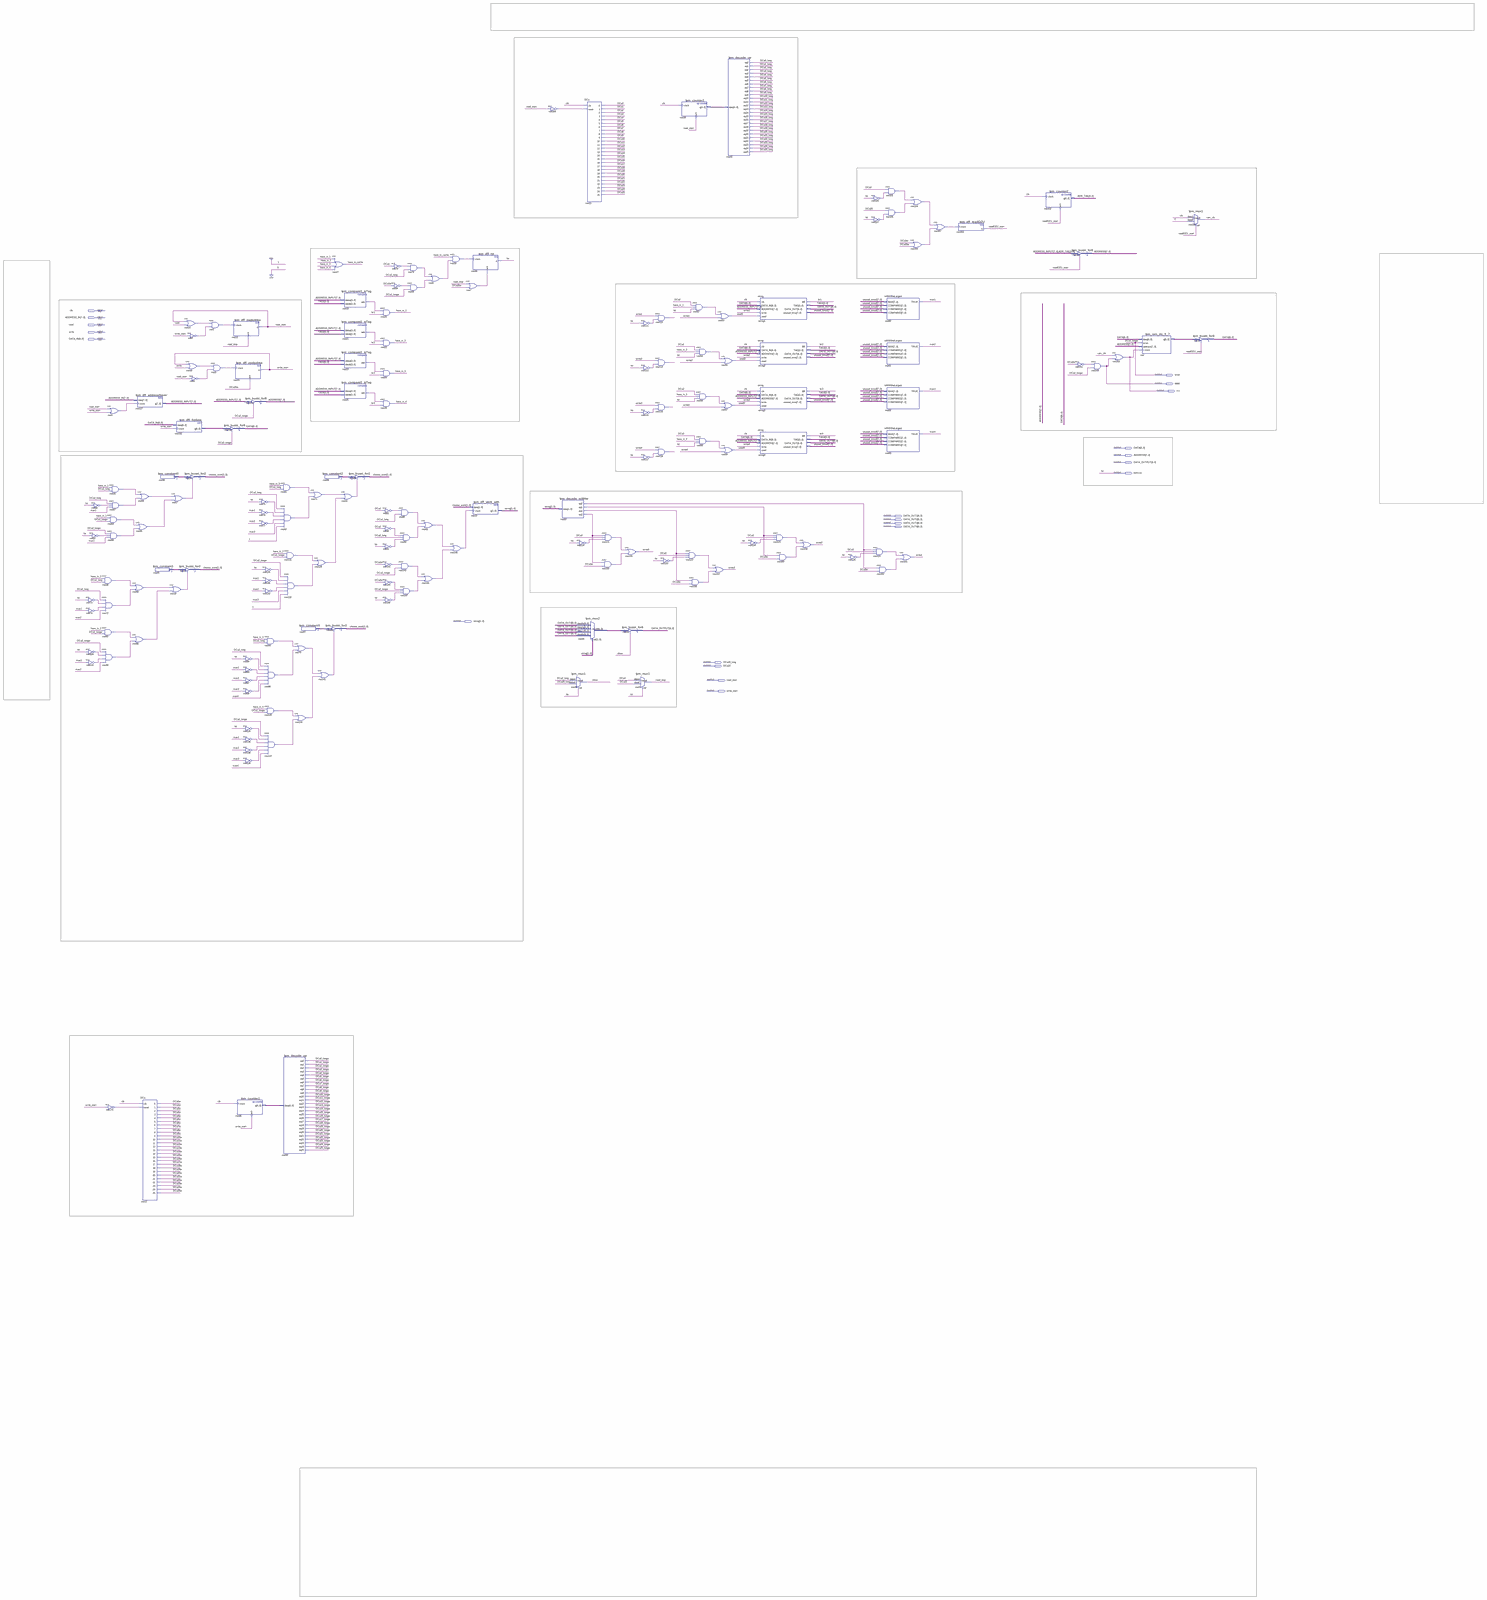
[diagram p0: schematic sheet, whole]
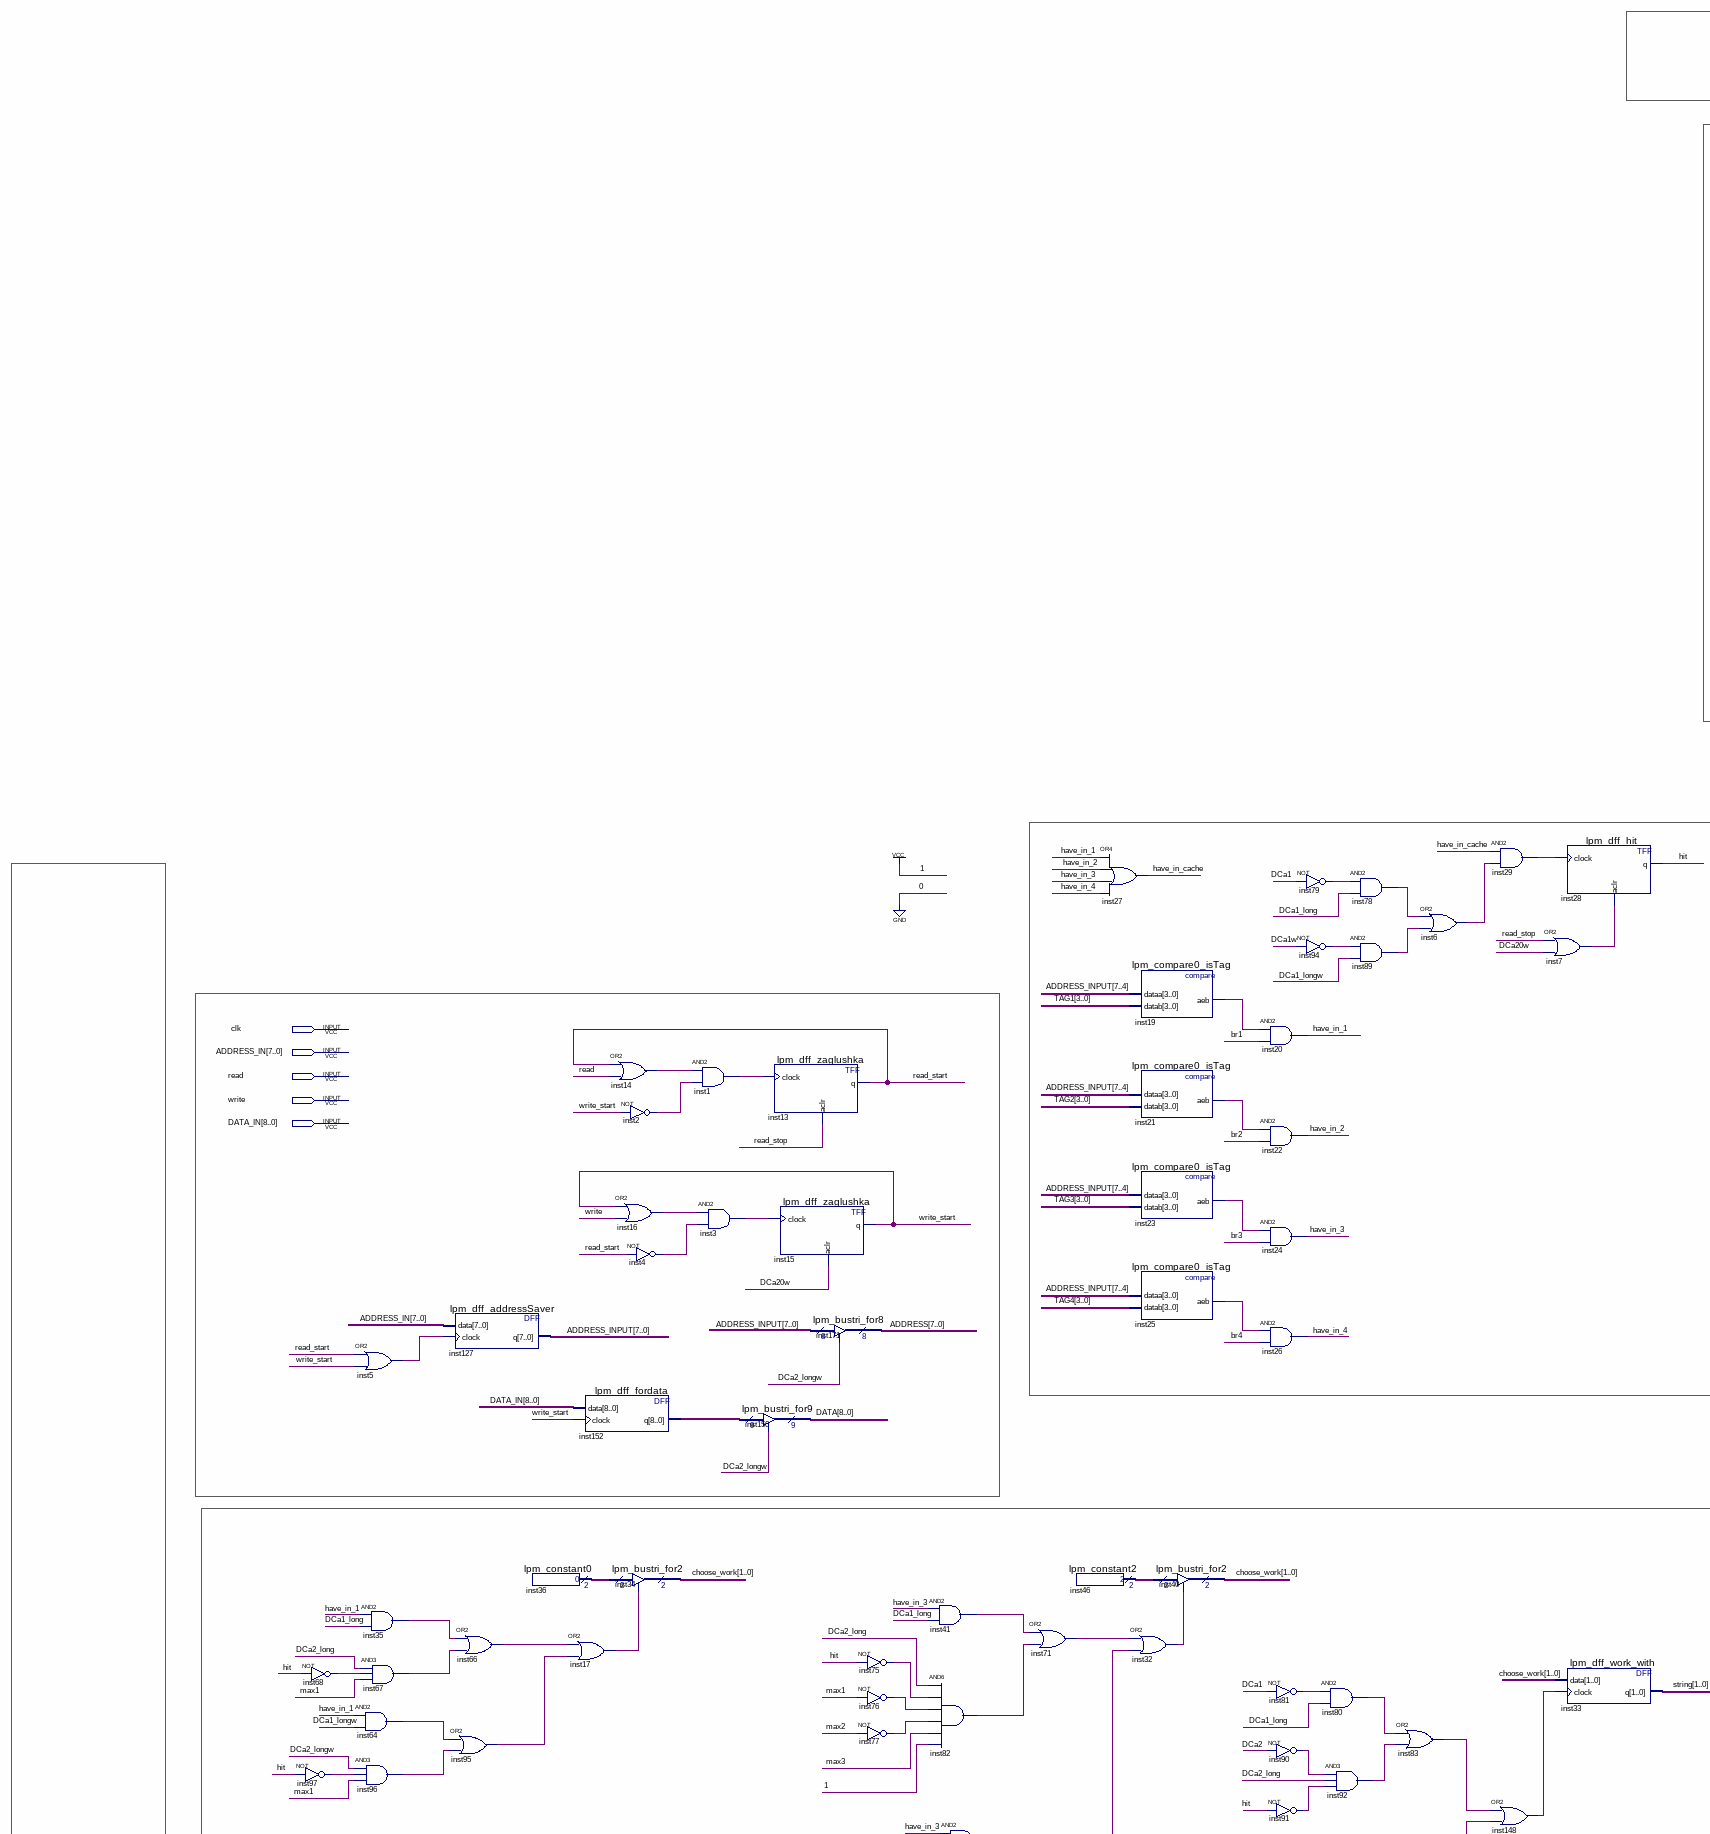
[diagram p1: schematic sheet, upper left part]
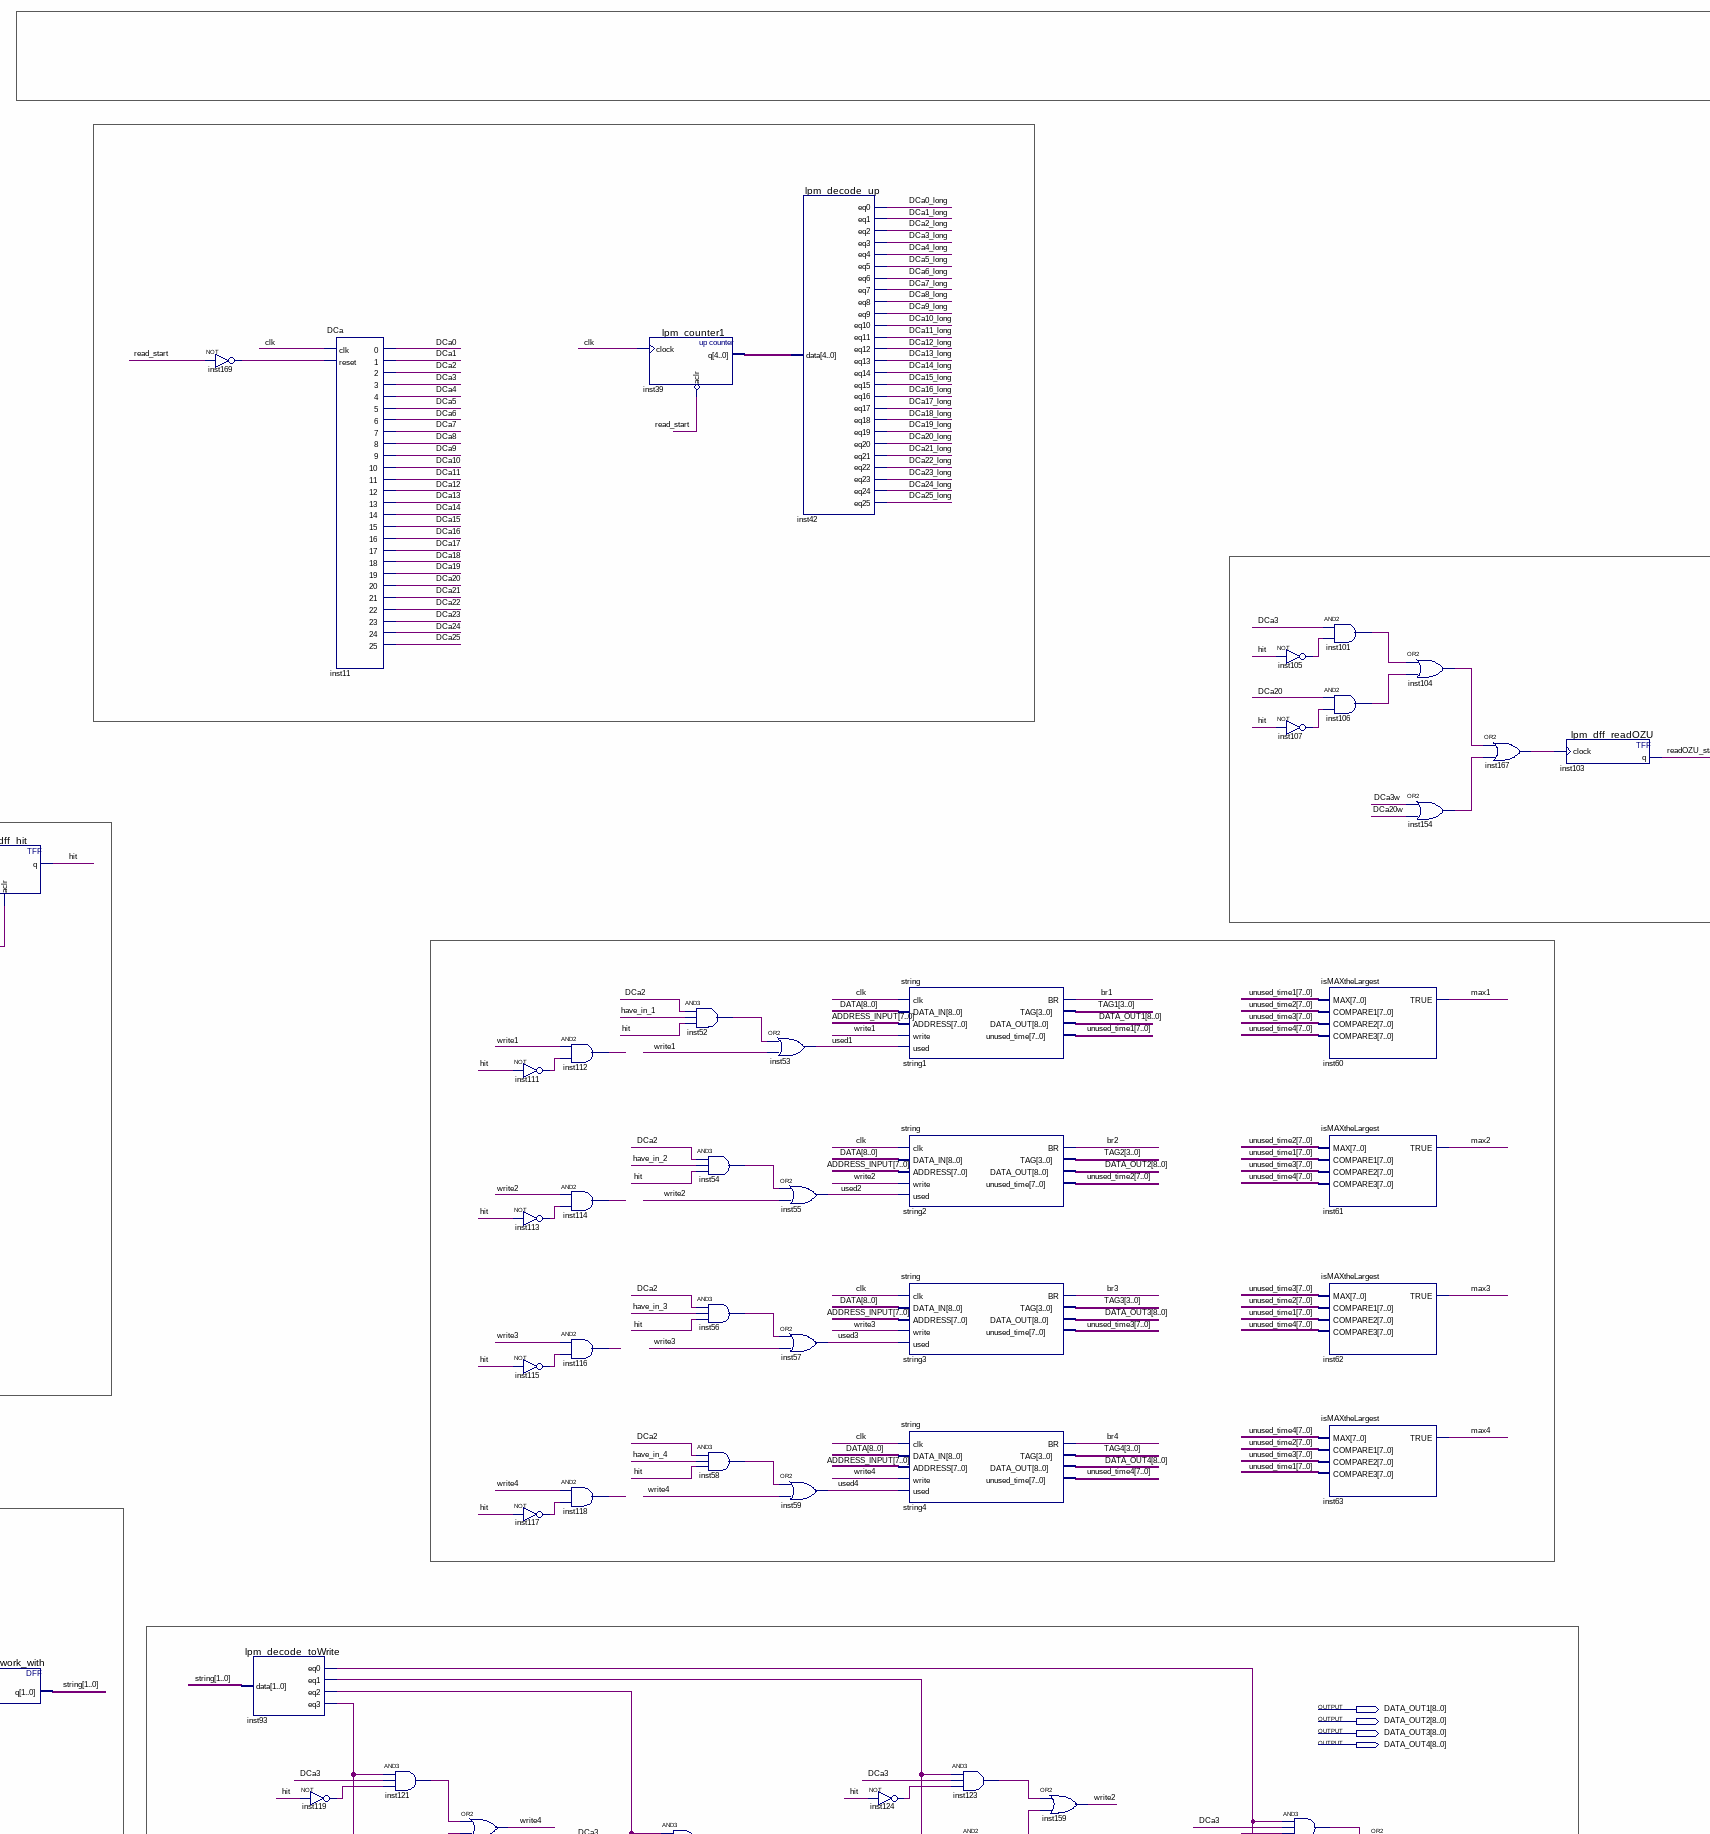
[diagram p2: schematic sheet, upper centre part]
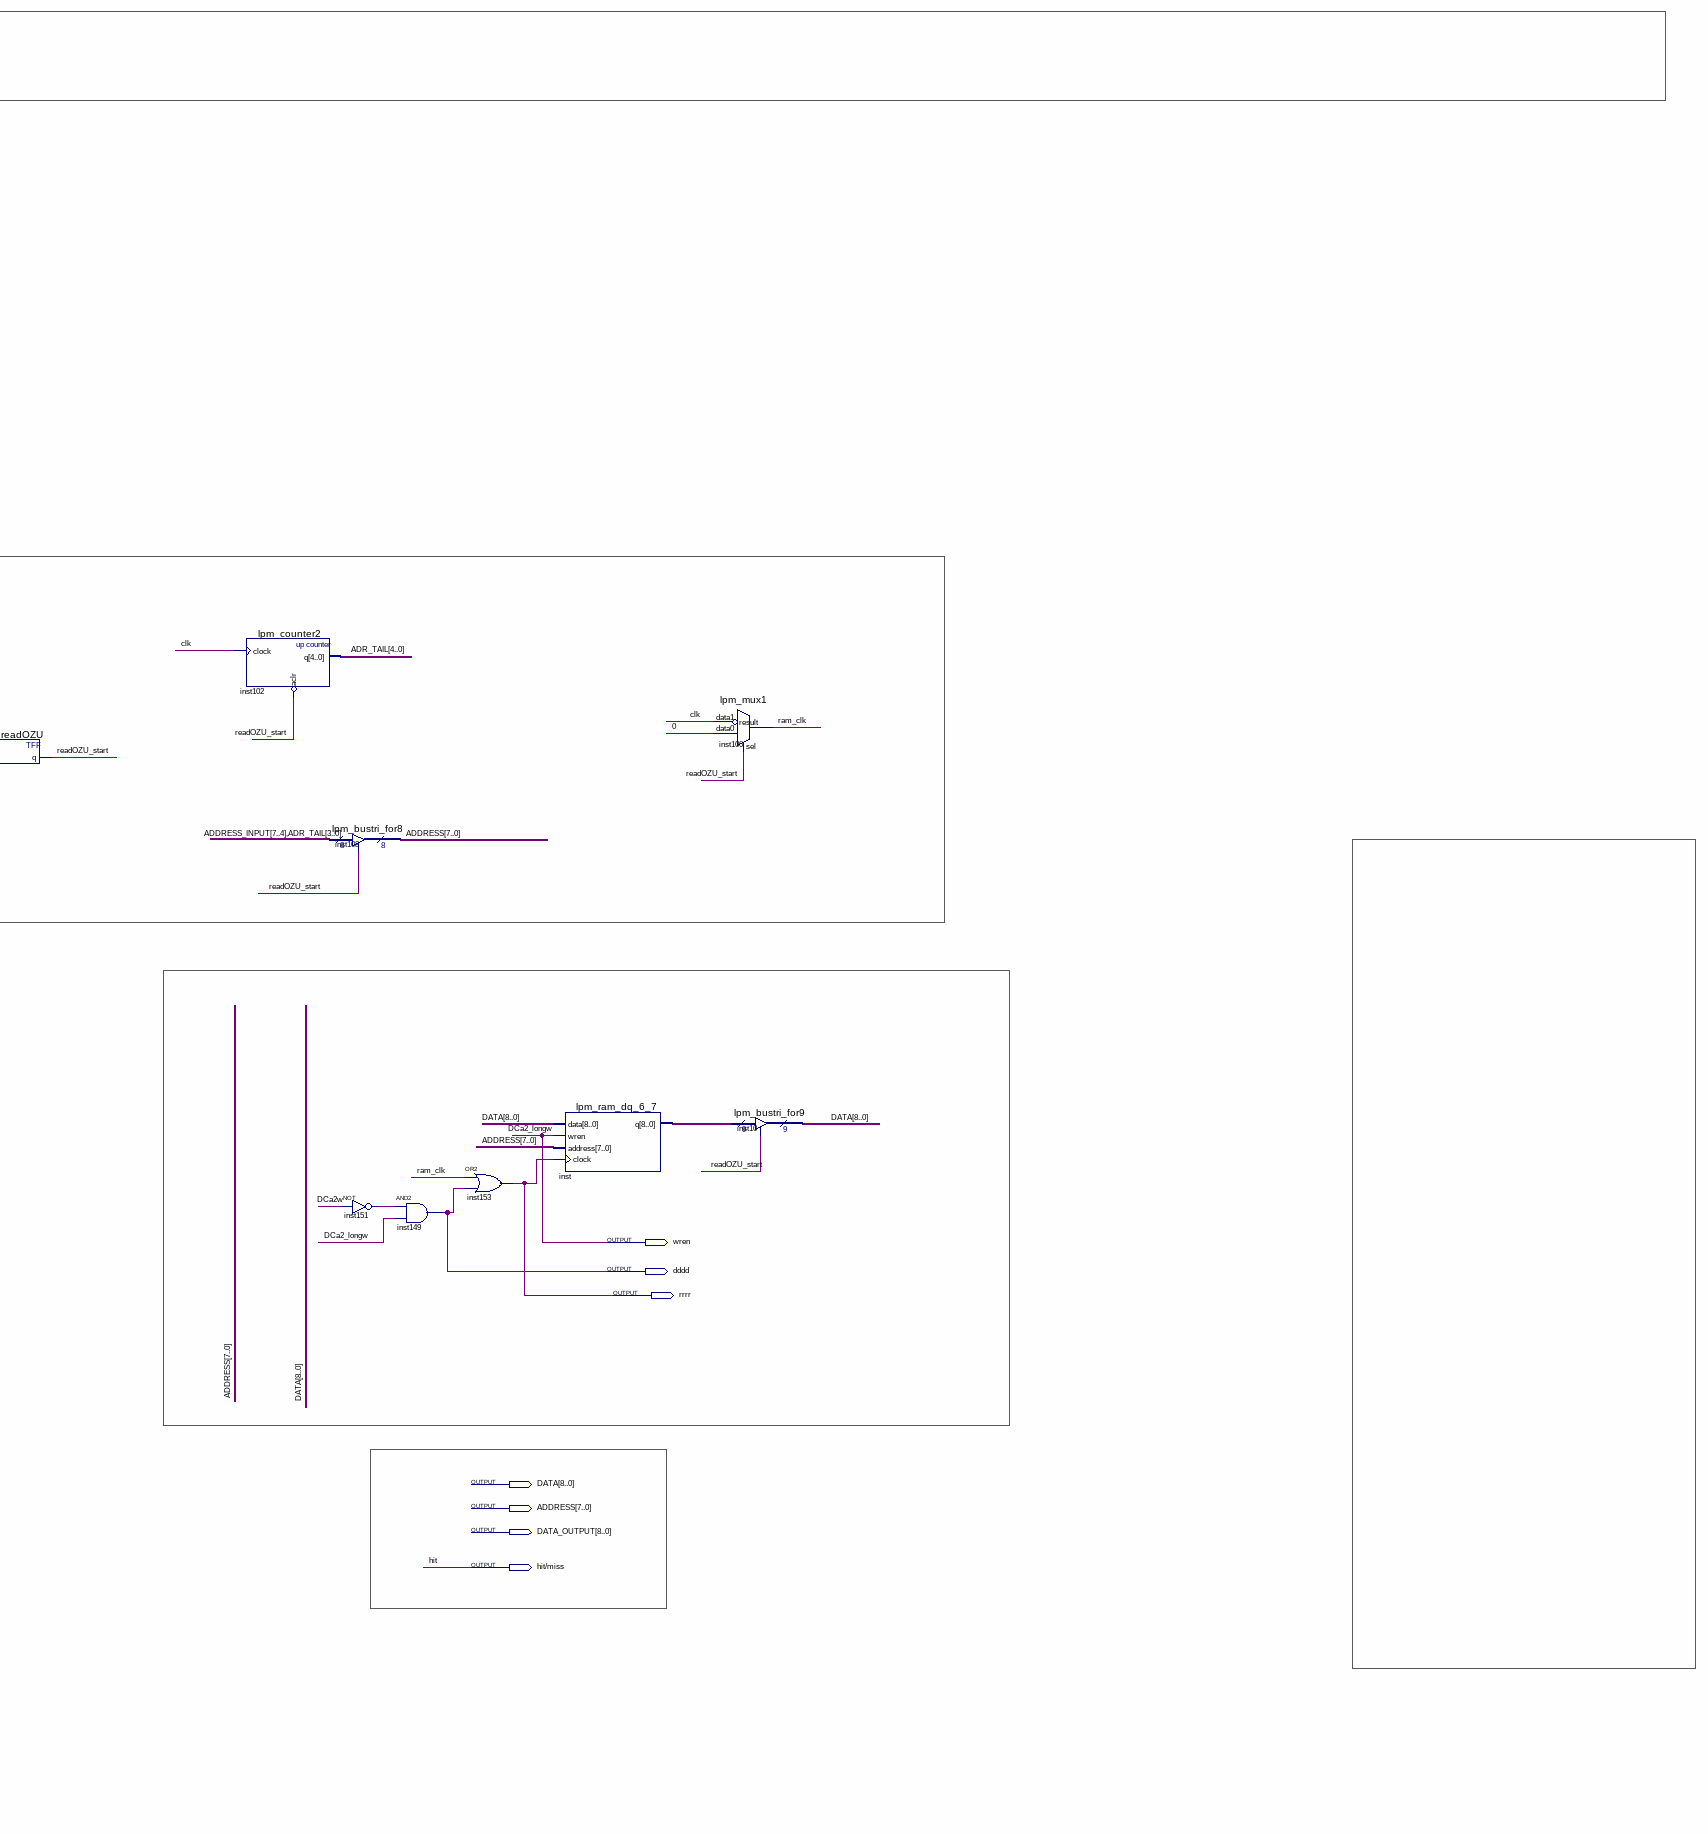
[diagram p3: schematic sheet, upper right part]
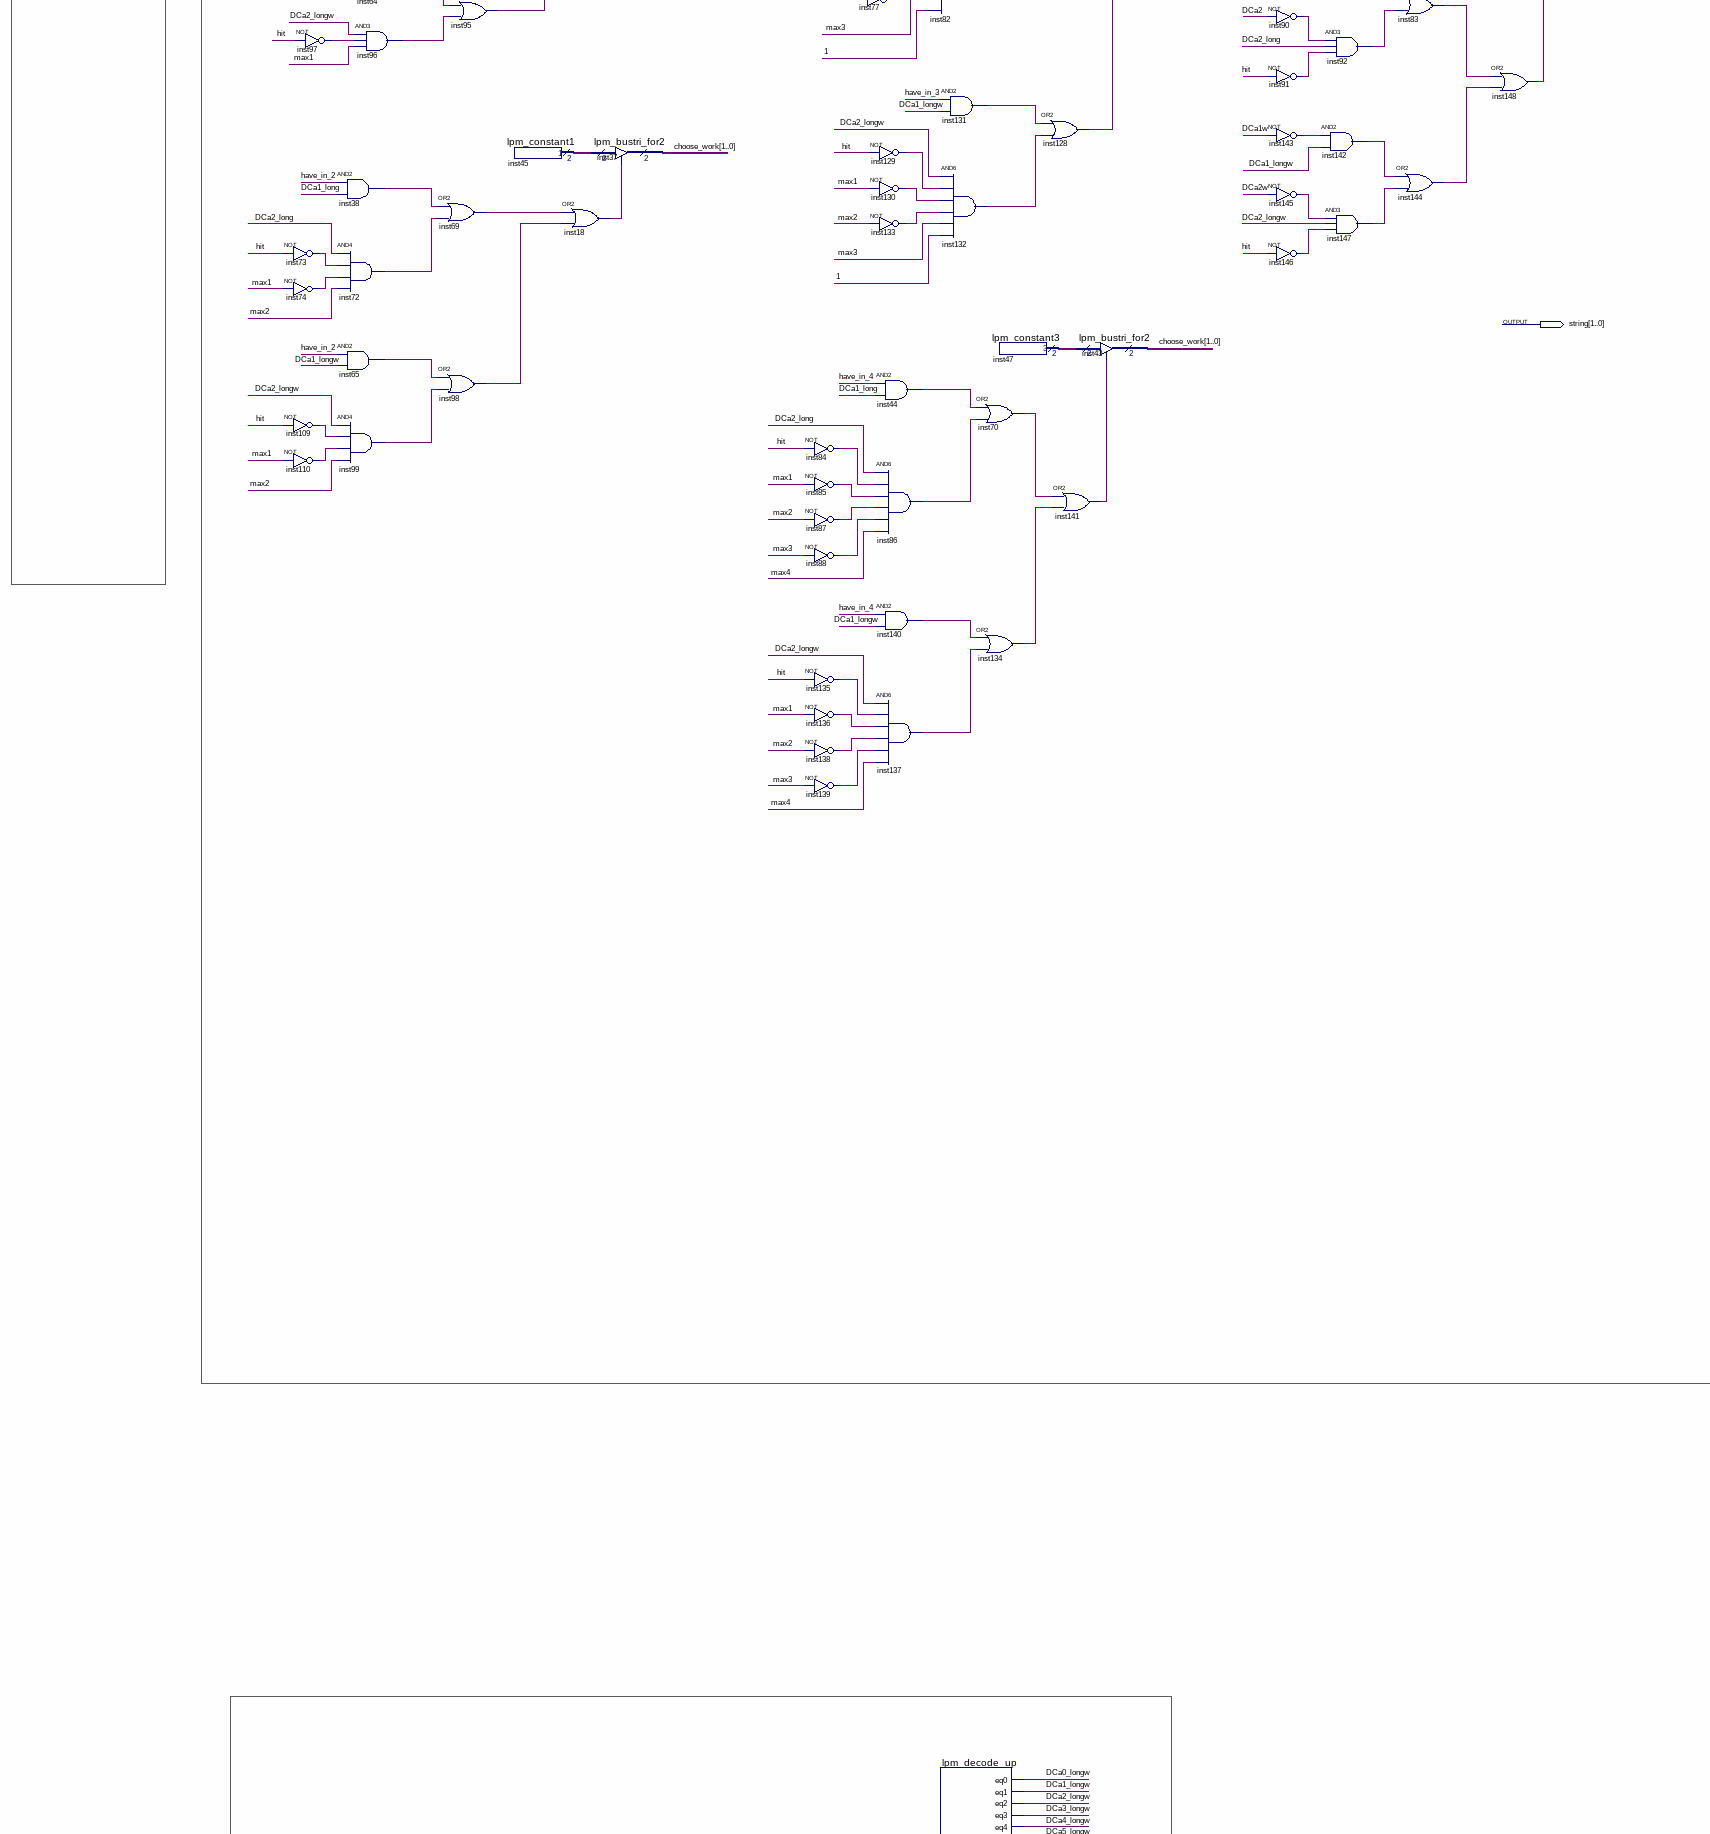
[diagram p4: schematic sheet, middle left part]
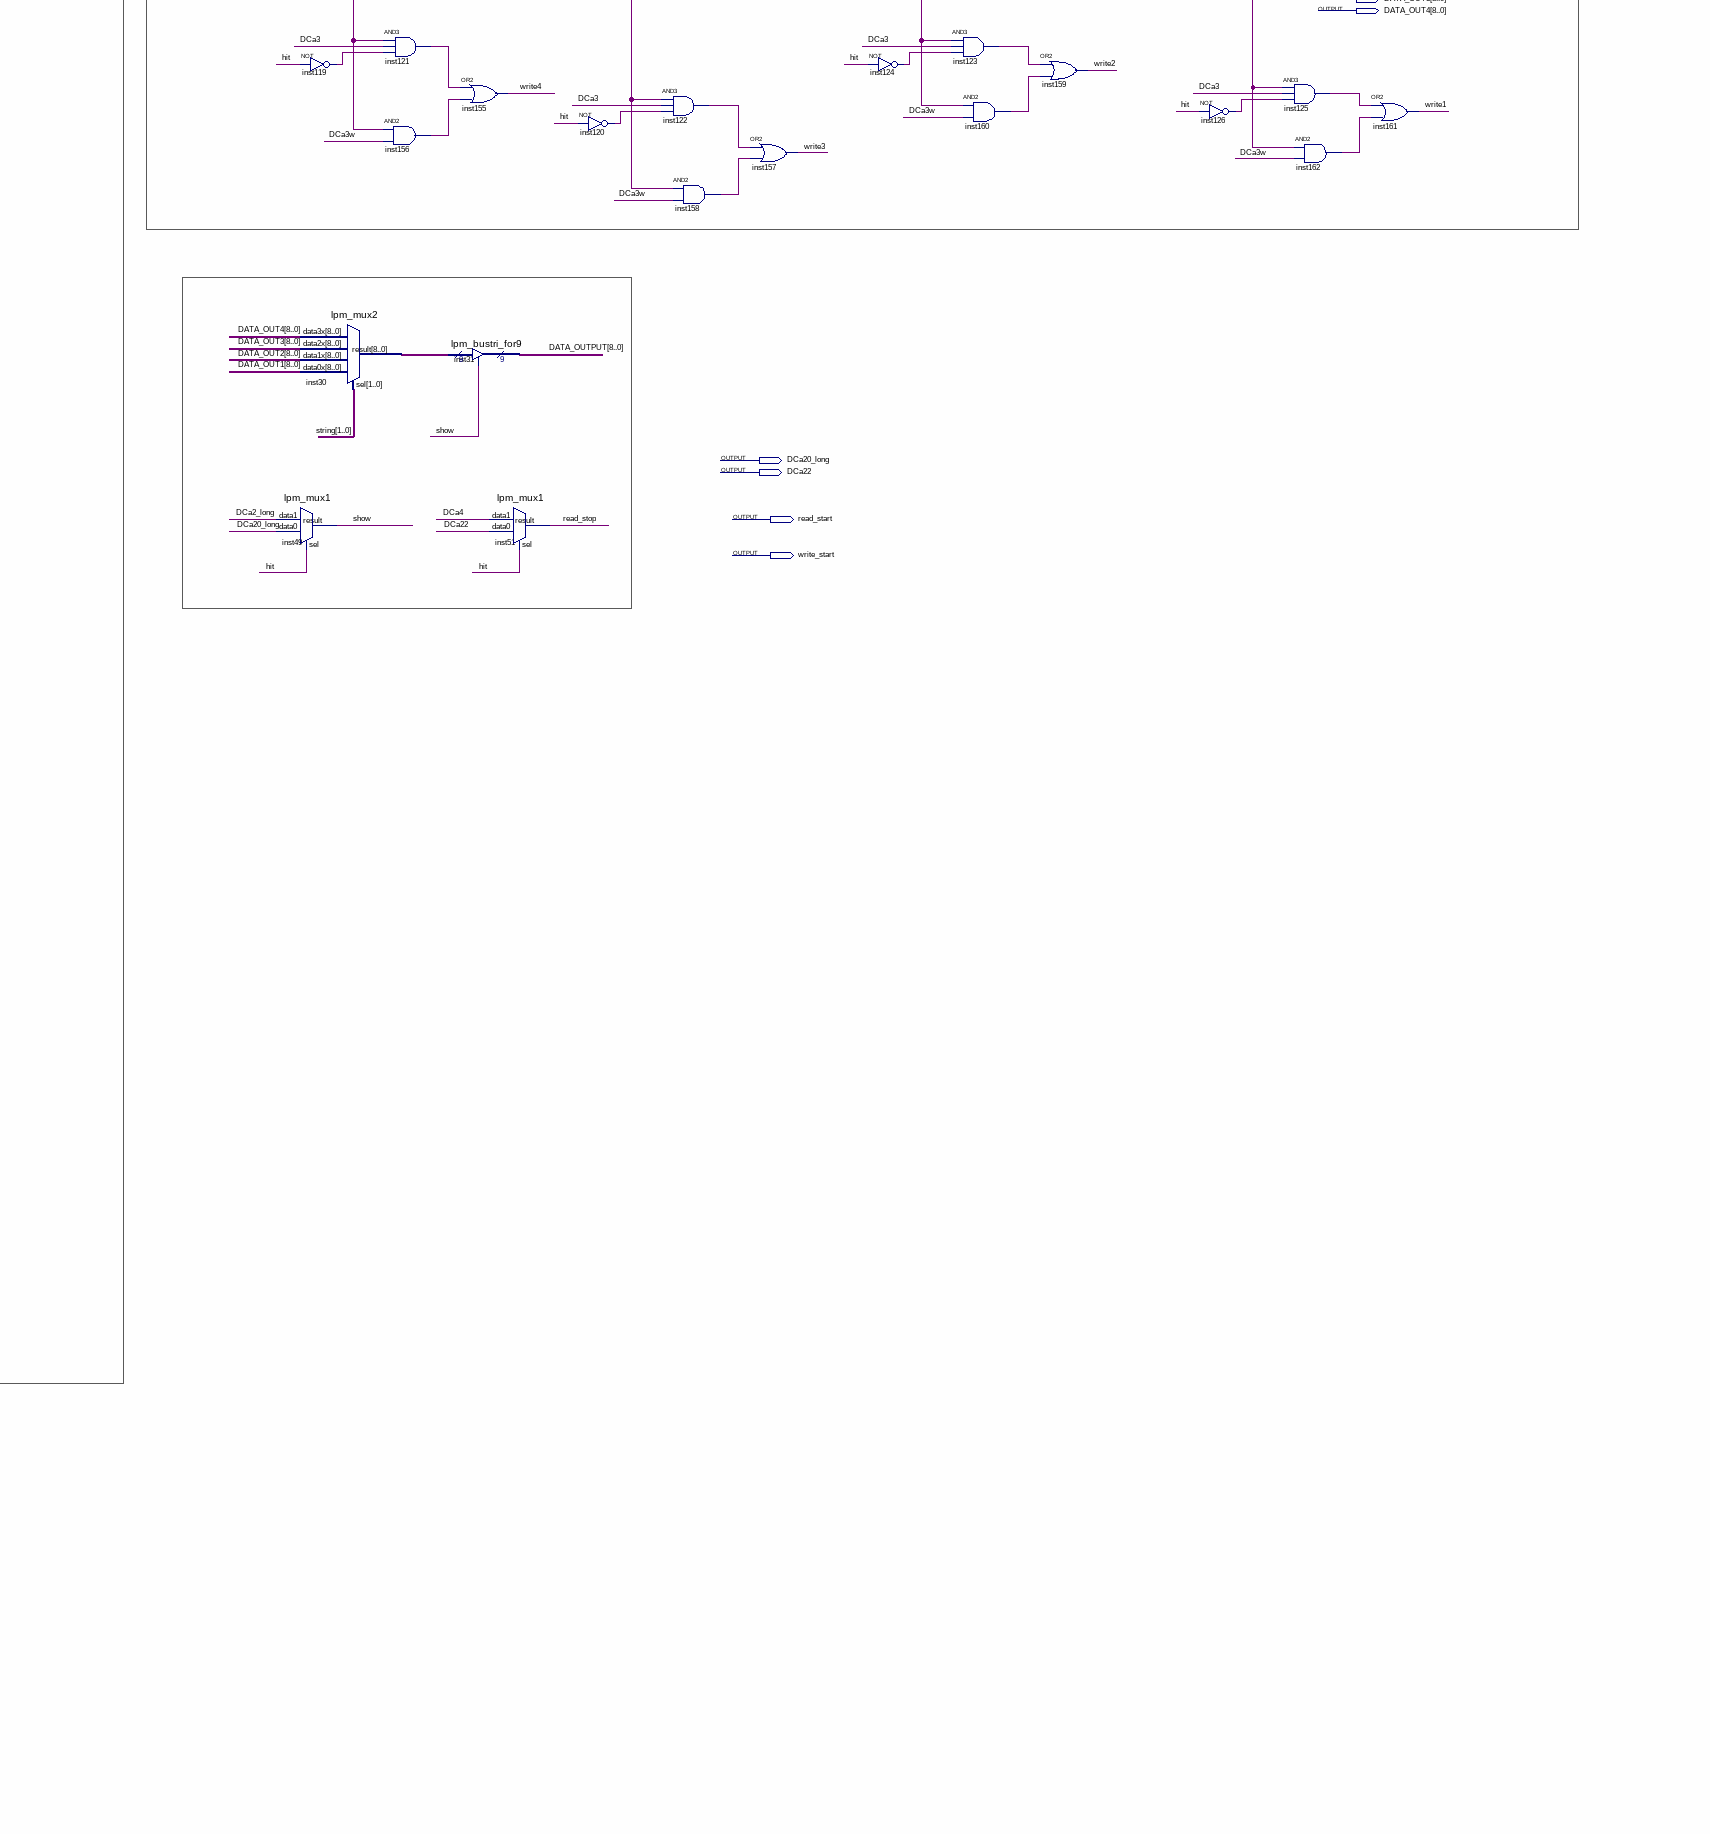
[diagram p5: schematic sheet, middle centre part]
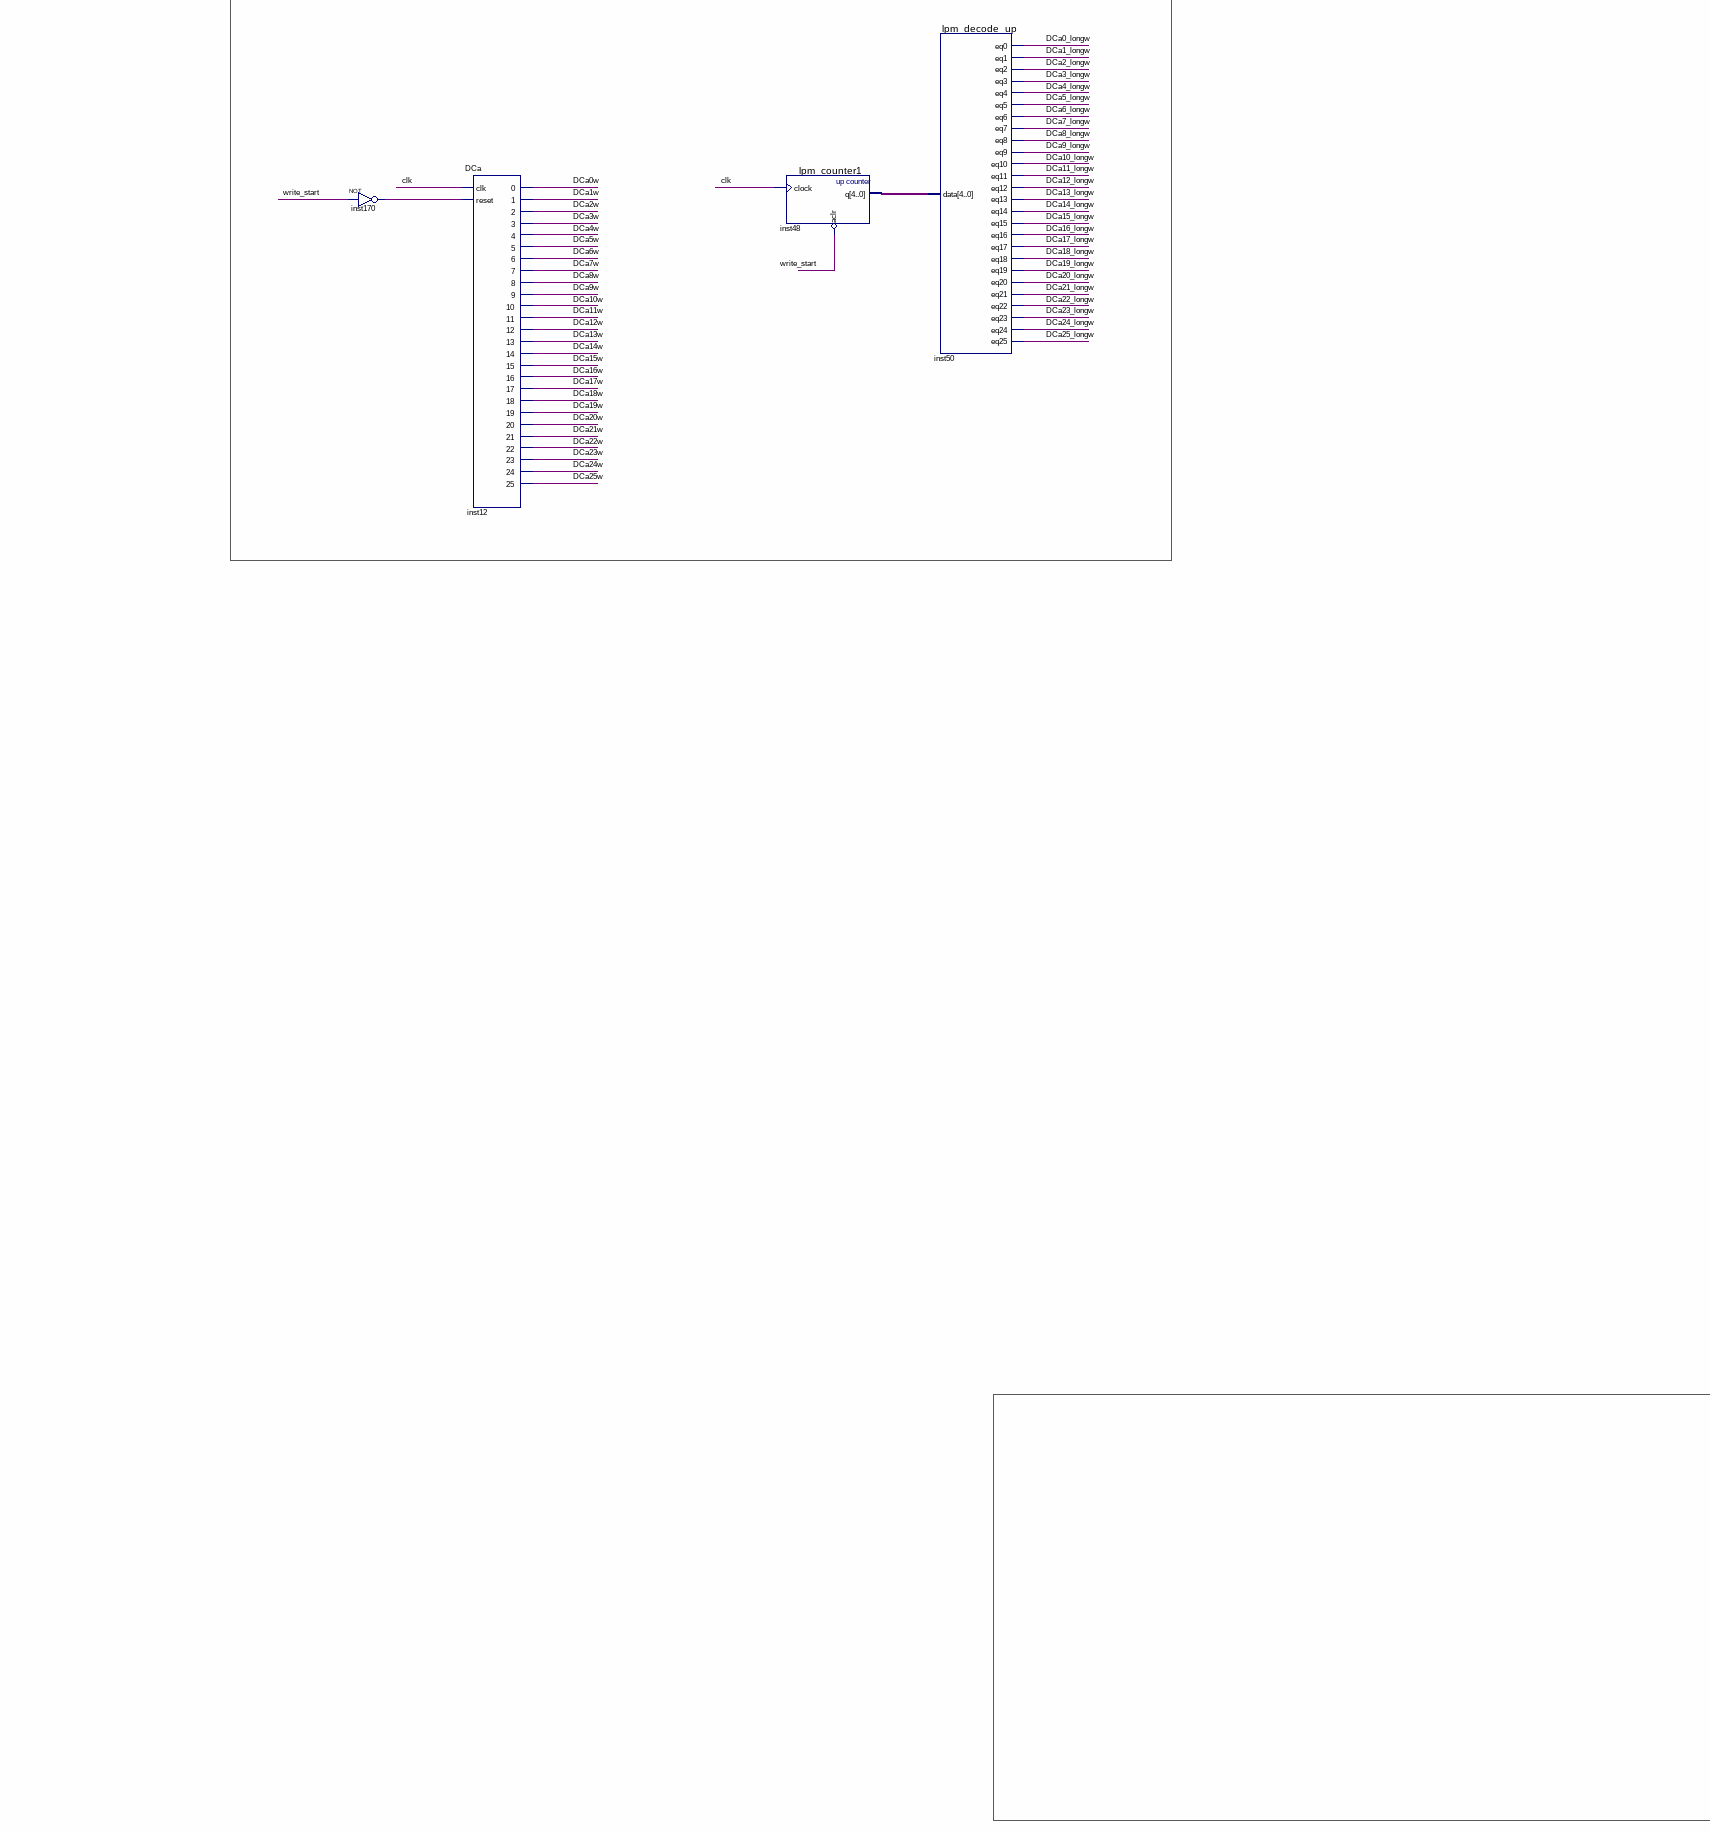
[diagram p6: schematic sheet, lower left part]
// Quartus schematic result.bdf as structural Verilog: 169 symbols, 21 pins
module result (
  input  clk,
  input  [7:0] ADDRESS_IN,
  input  read,
  input  write,
  input  [8:0] DATA_IN,
  output wren,
  output dddd,
  output rrrr,
  output [8:0] DATA,
  output [7:0] ADDRESS,
  output [8:0] DATA_OUTPUT,
  output \hit/miss ,
  output [8:0] DATA_OUT1,
  output [8:0] DATA_OUT2,
  output [8:0] DATA_OUT3,
  output [8:0] DATA_OUT4,
  output [1:0] \string ,
  output DCa20_long,
  output DCa22,
  output read_start,
  output write_start
);

  wire br1, br2, br3, br4, DCa0, DCa0_long, DCa0_longw, DCa0w, DCa1, DCa1_long, DCa1_longw, DCa1w, DCa2,
       DCa2_long, DCa2w, DCa3, DCa3_long, DCa3_longw, DCa3w, DCa4, DCa4_long, DCa4_longw, DCa4w, DCa5,
       DCa5_long, DCa5_longw, DCa5w, DCa6, DCa6_long, DCa6_longw, DCa6w, DCa7, DCa7_long, DCa7_longw, DCa7w,
       DCa8, DCa8_long, DCa8_longw, DCa8w, DCa9, DCa9_long, DCa9_longw, DCa9w, DCa10, DCa10_long,
       DCa10_longw, DCa10w, DCa11, DCa11_long, DCa11_longw, DCa11w, DCa12, DCa12_long, DCa12_longw, DCa12w,
       DCa13, DCa13_long, DCa13_longw, DCa13w, DCa14, DCa14_long, DCa14_longw, DCa14w, DCa15, DCa15_long,
       DCa15_longw, DCa15w, DCa16, DCa16_long, DCa16_longw, DCa16w, DCa17, DCa17_long, DCa17_longw, DCa17w,
       DCa18, DCa18_long, DCa18_longw, DCa18w, DCa19, DCa19_long, DCa19_longw, DCa19w, DCa20, DCa20_longw,
       DCa20w, DCa21, DCa21_long, DCa21_longw, DCa21w, DCa22_long, DCa22_longw, DCa22w, DCa23, DCa23_long,
       DCa23_longw, DCa23w, DCa24, DCa24_long, DCa24_longw, DCa24w, DCa25, DCa25_long, DCa25_longw, DCa25w,
       have_in_1, have_in_2, have_in_3, have_in_4, have_in_cache, inst1_out, inst2_out, inst3_out, inst4_out,
       inst5_out, inst6_out, inst7_out, inst14_out, inst16_out, inst17_out, inst18_out, inst19_aeb,
       inst21_aeb, inst23_aeb, inst25_aeb, inst29_out, inst32_out, inst35_out, inst38_out, inst41_out,
       inst44_out, inst52_out, inst54_out, inst56_out, inst58_out, inst64_out, inst65_out, inst66_out,
       inst67_out, inst68_out, inst69_out, inst70_out, inst71_out, inst72_out, inst73_out, inst74_out,
       inst75_out, inst76_out, inst77_out, inst78_out, inst79_out, inst80_out, inst81_out, inst82_out,
       inst83_out, inst84_out, inst85_out, inst86_out, inst87_out, inst88_out, inst89_out, inst90_out,
       inst91_out, inst92_out, inst93_eq0, inst93_eq1, inst93_eq2, inst93_eq3, inst94_out, inst95_out,
       inst96_out, inst97_out, inst98_out, inst99_out, inst101_out, inst104_out, inst105_out, inst106_out,
       inst107_out, inst109_out, inst110_out, inst111_out, inst112_out, inst113_out, inst114_out,
       inst115_out, inst116_out, inst117_out, inst118_out, inst119_out, inst120_out, inst121_out,
       inst122_out, inst123_out, inst124_out, inst125_out, inst126_out, inst128_out, inst129_out,
       inst130_out, inst131_out, inst132_out, inst133_out, inst134_out, inst135_out, inst136_out,
       inst137_out, inst138_out, inst139_out, inst140_out, inst141_out, inst142_out, inst143_out,
       inst144_out, inst145_out, inst146_out, inst147_out, inst148_out, inst151_out, inst154_out,
       inst156_out, inst158_out, inst160_out, inst162_out, inst167_out, inst169_out, inst170_out, max1, max2,
       max3, max4, ram_clk, read_stop, readOZU_start, show, used1, used2, used3, used4, write1, write2,
       write3, write4;
  wire [1:0] choose_work, inst36_result, inst45_result, inst46_result, inst47_result;
  wire [3:0] TAG1, TAG2, TAG3, TAG4;
  wire [4:0] ADR_TAIL, inst39_q, inst48_q;
  wire [7:0] ADDRESS_INPUT, unused_time1, unused_time2, unused_time3, unused_time4;
  wire [8:0] inst30_result, inst152_q, inst_q;

  not inst73 (inst73_out, \hit/miss );
  not inst74 (inst74_out, max1);
  not inst109 (inst109_out, \hit/miss );
  not inst110 (inst110_out, max1);
  not inst68 (inst68_out, \hit/miss );
  not inst97 (inst97_out, \hit/miss );
  and inst38 (inst38_out, have_in_2, DCa1_long);
  and inst72 (inst72_out, DCa2_long, inst73_out, inst74_out, max2);
  and inst65 (inst65_out, have_in_2, DCa1_longw);
  and inst99 (inst99_out, wren, inst109_out, inst110_out, max2);
  or inst5 (inst5_out, read_start, write_start);
  and inst35 (inst35_out, have_in_1, DCa1_long);
  and inst67 (inst67_out, DCa2_long, inst68_out, max1);
  and inst64 (inst64_out, have_in_1, DCa1_longw);
  and inst96 (inst96_out, wren, inst97_out, max1);
  not inst170 (inst170_out, write_start);
  lpm_dff_addressSaver inst127 (.data(ADDRESS_IN), .clock(inst5_out), .q(ADDRESS_INPUT));
  or inst66 (inst66_out, inst35_out, inst67_out);
  or inst95 (inst95_out, inst64_out, inst96_out);
  or inst69 (inst69_out, inst38_out, inst72_out);
  or inst98 (inst98_out, inst65_out, inst99_out);
  DCa inst12 (
    .clk(clk), .reset(inst170_out), .\0 (DCa0w), .\1 (DCa1w), .\2 (DCa2w), .\3 (DCa3w), .\4 (DCa4w),
    .\5 (DCa5w), .\6 (DCa6w), .\7 (DCa7w), .\8 (DCa8w), .\9 (DCa9w), .\10 (DCa10w), .\11 (DCa11w),
    .\12 (DCa12w), .\13 (DCa13w), .\14 (DCa14w), .\15 (DCa15w), .\16 (DCa16w), .\17 (DCa17w), .\18 (DCa18w),
    .\19 (DCa19w), .\20 (DCa20w), .\21 (DCa21w), .\22 (DCa22w), .\23 (DCa23w), .\24 (DCa24w), .\25 (DCa25w));
  lpm_constant0 inst36 (.result(inst36_result));
  lpm_constant1 inst45 (.result(inst45_result));
  lpm_dff_fordata inst152 (.data(DATA_IN), .clock(write_start), .q(inst152_q));
  or inst17 (inst17_out, inst66_out, inst95_out);
  or inst18 (inst18_out, inst69_out, inst98_out);
  or inst14 (inst14_out, read_start, read);
  not inst2 (inst2_out, write_start);
  or inst16 (inst16_out, write_start, write);
  lpm_bustri_for2 inst34 (.enabledt(inst17_out), .data(inst36_result), .tridata(choose_work));
  lpm_bustri_for2 inst37 (.enabledt(inst18_out), .data(inst45_result), .tridata(choose_work));
  not inst4 (inst4_out, read_start);
  and inst1 (inst1_out, inst14_out, inst2_out);
  and inst3 (inst3_out, inst16_out, inst4_out);
  lpm_dff_zaglushka inst13 (.clock(inst1_out), .aclr(read_stop), .q(read_start));
  lpm_bustri_for9 inst150 (.enabledt(wren), .data(inst152_q), .tridata(DATA));
  lpm_dff_zaglushka inst15 (.clock(inst3_out), .aclr(DCa20w), .q(write_start));
  lpm_bustri_for8 inst171 (.enabledt(wren), .data(ADDRESS_INPUT), .tridata(ADDRESS));
  not inst84 (inst84_out, \hit/miss );
  not inst85 (inst85_out, max1);
  not inst87 (inst87_out, max2);
  not inst88 (inst88_out, max3);
  not inst135 (inst135_out, \hit/miss );
  not inst136 (inst136_out, max1);
  not inst138 (inst138_out, max2);
  not inst139 (inst139_out, max3);
  lpm_counter1 inst48 (.clock(clk), .aclr(~write_start), .q(inst48_q));
  not inst75 (inst75_out, \hit/miss );
  not inst76 (inst76_out, max1);
  not inst77 (inst77_out, max2);
  not inst129 (inst129_out, \hit/miss );
  not inst130 (inst130_out, max1);
  not inst133 (inst133_out, max2);
  and inst44 (inst44_out, have_in_4, DCa1_long);
  and inst86 (inst86_out, DCa2_long, inst84_out, inst85_out, inst87_out, inst88_out, max4);
  and inst140 (inst140_out, have_in_4, DCa1_longw);
  and inst137 (inst137_out, wren, inst135_out, inst136_out, inst138_out, inst139_out, max4);
  and inst41 (inst41_out, have_in_3, DCa1_long);
  and inst82 (inst82_out, DCa2_long, inst75_out, inst76_out, inst77_out, max3, 1'b1);
  and inst131 (inst131_out, have_in_3, DCa1_longw);
  and inst132 (inst132_out, wren, inst129_out, inst130_out, inst133_out, max3, 1'b1);
  lpm_decode_up inst50 (
    .data(inst48_q), .eq0(DCa0_longw), .eq1(DCa1_longw), .eq2(wren), .eq3(DCa3_longw), .eq4(DCa4_longw),
    .eq5(DCa5_longw), .eq6(DCa6_longw), .eq7(DCa7_longw), .eq8(DCa8_longw), .eq9(DCa9_longw),
    .eq10(DCa10_longw), .eq11(DCa11_longw), .eq12(DCa12_longw), .eq13(DCa13_longw), .eq14(DCa14_longw),
    .eq15(DCa15_longw), .eq16(DCa16_longw), .eq17(DCa17_longw), .eq18(DCa18_longw), .eq19(DCa19_longw),
    .eq20(DCa20_longw), .eq21(DCa21_longw), .eq22(DCa22_longw), .eq23(DCa23_longw), .eq24(DCa24_longw),
    .eq25(DCa25_longw));
  lpm_constant3 inst47 (.result(inst47_result));
  or inst70 (inst70_out, inst44_out, inst86_out);
  or inst134 (inst134_out, inst140_out, inst137_out);
  or inst71 (inst71_out, inst41_out, inst82_out);
  or inst128 (inst128_out, inst131_out, inst132_out);
  lpm_constant2 inst46 (.result(inst46_result));
  lpm_bustri_for2 inst43 (.enabledt(inst141_out), .data(inst47_result), .tridata(choose_work));
  or inst141 (inst141_out, inst70_out, inst134_out);
  or inst27 (have_in_cache, have_in_1, have_in_2, have_in_3, have_in_4);
  lpm_compare0_isTag inst19 (.dataa(ADDRESS_INPUT[7:4]), .datab(TAG1), .aeb(inst19_aeb));
  lpm_compare0_isTag inst21 (.dataa(ADDRESS_INPUT[7:4]), .datab(TAG2), .aeb(inst21_aeb));
  lpm_compare0_isTag inst23 (.dataa(ADDRESS_INPUT[7:4]), .datab(TAG3), .aeb(inst23_aeb));
  lpm_compare0_isTag inst25 (.dataa(ADDRESS_INPUT[7:4]), .datab(TAG4), .aeb(inst25_aeb));
  or inst32 (inst32_out, inst71_out, inst128_out);
  lpm_bustri_for2 inst40 (.enabledt(inst32_out), .data(inst46_result), .tridata(choose_work));
  and inst20 (have_in_1, inst19_aeb, br1);
  and inst22 (have_in_2, inst21_aeb, br2);
  and inst24 (have_in_3, inst23_aeb, br3);
  and inst26 (have_in_4, inst25_aeb, br4);
  not inst81 (inst81_out, DCa1);
  not inst90 (inst90_out, DCa2);
  not inst91 (inst91_out, \hit/miss );
  not inst143 (inst143_out, DCa1w);
  not inst145 (inst145_out, DCa2w);
  not inst146 (inst146_out, \hit/miss );
  not inst79 (inst79_out, DCa1);
  not inst94 (inst94_out, DCa1w);
  and inst80 (inst80_out, inst81_out, DCa1_long);
  and inst92 (inst92_out, inst90_out, DCa2_long, inst91_out);
  and inst142 (inst142_out, inst143_out, DCa1_longw);
  and inst147 (inst147_out, inst145_out, wren, inst146_out);
  and inst78 (inst78_out, inst79_out, DCa1_long);
  and inst89 (inst89_out, inst94_out, DCa1_longw);
  or inst6 (inst6_out, inst78_out, inst89_out);
  or inst83 (inst83_out, inst80_out, inst92_out);
  or inst144 (inst144_out, inst142_out, inst147_out);
  and inst29 (inst29_out, have_in_cache, inst6_out);
  or inst148 (inst148_out, inst83_out, inst144_out);
  lpm_dff_hit inst28 (.clock(inst29_out), .aclr(inst7_out), .q(\hit/miss ));
  or inst7 (inst7_out, read_stop, DCa20w);
  lpm_dff_work_with inst33 (.data(choose_work), .clock(inst148_out), .q(\string ));
  not inst169 (inst169_out, read_start);
  lpm_decode_toWrite inst93 (.data(\string ), .eq0(inst93_eq0), .eq1(inst93_eq1), .eq2(inst93_eq2), .eq3(inst93_eq3));
  lpm_mux1 inst49 (.data1(DCa2_long), .data0(DCa20_long), .sel(\hit/miss ), .result(show));
  DCa inst11 (
    .clk(clk), .reset(inst169_out), .\0 (DCa0), .\1 (DCa1), .\2 (DCa2), .\3 (DCa3), .\4 (DCa4), .\5 (DCa5),
    .\6 (DCa6), .\7 (DCa7), .\8 (DCa8), .\9 (DCa9), .\10 (DCa10), .\11 (DCa11), .\12 (DCa12), .\13 (DCa13),
    .\14 (DCa14), .\15 (DCa15), .\16 (DCa16), .\17 (DCa17), .\18 (DCa18), .\19 (DCa19), .\20 (DCa20),
    .\21 (DCa21), .\22 (DCa22), .\23 (DCa23), .\24 (DCa24), .\25 (DCa25));
  not inst119 (inst119_out, \hit/miss );
  lpm_mux2 inst30 (
    .data3x(DATA_OUT4), .data2x(DATA_OUT3), .data1x(DATA_OUT2), .data0x(DATA_OUT1), .sel(\string ),
    .result(inst30_result));
  and inst121 (inst121_out, inst93_eq3, DCa3, inst119_out);
  and inst156 (inst156_out, inst93_eq3, DCa3w);
  or inst155 (write4, inst121_out, inst156_out);
  lpm_bustri_for9 inst31 (.enabledt(show), .data(inst30_result), .tridata(DATA_OUTPUT));
  not inst111 (inst111_out, \hit/miss );
  not inst113 (inst113_out, \hit/miss );
  not inst115 (inst115_out, \hit/miss );
  not inst117 (inst117_out, \hit/miss );
  lpm_mux1 inst51 (.data1(DCa4), .data0(DCa22), .sel(\hit/miss ), .result(read_stop));
  and inst112 (inst112_out, write1, inst111_out);
  and inst114 (inst114_out, write2, inst113_out);
  and inst116 (inst116_out, write3, inst115_out);
  and inst118 (inst118_out, write4, inst117_out);
  not inst120 (inst120_out, \hit/miss );
  lpm_counter1 inst39 (.clock(clk), .aclr(~read_start), .q(inst39_q));
  and inst122 (inst122_out, inst93_eq2, DCa3, inst120_out);
  and inst52 (inst52_out, DCa2, have_in_1, \hit/miss );
  and inst54 (inst54_out, DCa2, have_in_2, \hit/miss );
  and inst56 (inst56_out, DCa2, have_in_3, \hit/miss );
  and inst58 (inst58_out, DCa2, have_in_4, \hit/miss );
  and inst158 (inst158_out, inst93_eq2, DCa3w);
  or inst157 (write3, inst122_out, inst158_out);
  lpm_decode_up inst42 (
    .data(inst39_q), .eq0(DCa0_long), .eq1(DCa1_long), .eq2(DCa2_long), .eq3(DCa3_long), .eq4(DCa4_long),
    .eq5(DCa5_long), .eq6(DCa6_long), .eq7(DCa7_long), .eq8(DCa8_long), .eq9(DCa9_long), .eq10(DCa10_long),
    .eq11(DCa11_long), .eq12(DCa12_long), .eq13(DCa13_long), .eq14(DCa14_long), .eq15(DCa15_long),
    .eq16(DCa16_long), .eq17(DCa17_long), .eq18(DCa18_long), .eq19(DCa19_long), .eq20(DCa20_long),
    .eq21(DCa21_long), .eq22(DCa22_long), .eq23(DCa23_long), .eq24(DCa24_long), .eq25(DCa25_long));
  or inst53 (used1, inst52_out, write1);
  or inst55 (used2, inst54_out, write2);
  or inst57 (used3, inst56_out, write3);
  or inst59 (used4, inst58_out, write4);
  \string  string1 (
    .clk(clk), .DATA_IN(DATA), .ADDRESS(ADDRESS_INPUT), .write(write1), .used(used1), .BR(br1), .TAG(TAG1),
    .DATA_OUT(DATA_OUT1), .unused_time(unused_time1));
  \string  string2 (
    .clk(clk), .DATA_IN(DATA), .ADDRESS(ADDRESS_INPUT), .write(write2), .used(used2), .BR(br2), .TAG(TAG2),
    .DATA_OUT(DATA_OUT2), .unused_time(unused_time2));
  \string  string3 (
    .clk(clk), .DATA_IN(DATA), .ADDRESS(ADDRESS_INPUT), .write(write3), .used(used3), .BR(br3), .TAG(TAG3),
    .DATA_OUT(DATA_OUT3), .unused_time(unused_time3));
  \string  string4 (
    .clk(clk), .DATA_IN(DATA), .ADDRESS(ADDRESS_INPUT), .write(write4), .used(used4), .BR(br4), .TAG(TAG4),
    .DATA_OUT(DATA_OUT4), .unused_time(unused_time4));
  not inst124 (inst124_out, \hit/miss );
  and inst123 (inst123_out, inst93_eq1, DCa3, inst124_out);
  and inst160 (inst160_out, inst93_eq1, DCa3w);
  or inst159 (write2, inst123_out, inst160_out);
  not inst126 (inst126_out, \hit/miss );
  not inst105 (inst105_out, \hit/miss );
  not inst107 (inst107_out, \hit/miss );
  and inst125 (inst125_out, inst93_eq0, DCa3, inst126_out);
  and inst101 (inst101_out, DCa3, inst105_out);
  and inst106 (inst106_out, DCa20, inst107_out);
  isMAXtheLargest inst60 (
    .MAX(unused_time1), .COMPARE1(unused_time2), .COMPARE2(unused_time3), .COMPARE3(unused_time4), .TRUE(max1));
  isMAXtheLargest inst61 (
    .MAX(unused_time2), .COMPARE1(unused_time1), .COMPARE2(unused_time3), .COMPARE3(unused_time4), .TRUE(max2));
  isMAXtheLargest inst62 (
    .MAX(unused_time3), .COMPARE1(unused_time2), .COMPARE2(unused_time1), .COMPARE3(unused_time4), .TRUE(max3));
  isMAXtheLargest inst63 (
    .MAX(unused_time4), .COMPARE1(unused_time2), .COMPARE2(unused_time3), .COMPARE3(unused_time1), .TRUE(max4));
  and inst162 (inst162_out, inst93_eq0, DCa3w);
  or inst161 (write1, inst125_out, inst162_out);
  or inst104 (inst104_out, inst101_out, inst106_out);
  or inst154 (inst154_out, DCa3w, DCa20w);
  or inst167 (inst167_out, inst104_out, inst154_out);
  lpm_dff_readOZU inst103 (.clock(inst167_out), .q(readOZU_start));
  lpm_counter2 inst102 (.clock(clk), .aclr(~readOZU_start), .q(ADR_TAIL));
  lpm_bustri_for8 inst108 (.enabledt(readOZU_start), .data({ADDRESS_INPUT[7:4], ADR_TAIL[3:0]}), .tridata(ADDRESS));
  not inst151 (inst151_out, DCa2w);
  and inst149 (dddd, inst151_out, wren);
  or inst153 (rrrr, ram_clk, dddd);
  lpm_ram_dq_6_7 inst (.data(DATA), .wren(wren), .address(ADDRESS), .clock(rrrr), .q(inst_q));
  lpm_mux1 inst100 (.data1(~clk), .data0(1'b0), .sel(readOZU_start), .result(ram_clk));
  lpm_bustri_for9 inst10 (.enabledt(readOZU_start), .data(inst_q), .tridata(DATA));

  // Other names for the same wires on the sheet: DCa2_longw = wren; hit = \hit/miss 
endmodule
